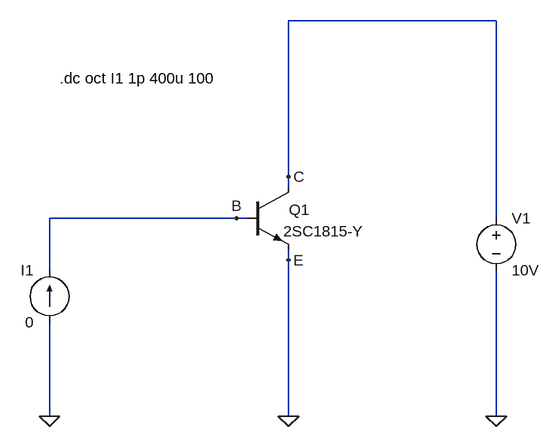
[diagram p0: schematic 1_jikken_vb.asc]
1_jikken_vb.asc, the LTspice schematic file:
Version 4
SHEET 1 880 680
WIRE 592 -112 272 -112
WIRE 272 128 272 -112
WIRE 272 144 272 128
WIRE 192 192 -96 192
WIRE 208 192 192 192
WIRE 592 192 592 -112
WIRE 272 256 272 240
WIRE -96 272 -96 192
WIRE -96 496 -96 352
WIRE 272 496 272 256
WIRE 592 496 592 272
FLAG -96 496 0
FLAG 272 496 0
FLAG 592 496 0
FLAG 272 256 E
FLAG 272 128 C
FLAG 192 192 B
SYMBOL npn 208 144 R0
WINDOW 0 65 35 Left 2
SYMATTR InstName Q1
SYMATTR Value 2SC1815-Y
SYMBOL voltage 592 176 R0
SYMATTR InstName V1
SYMATTR Value 10V
SYMBOL current -96 352 R180
WINDOW 0 24 80 Left 2
WINDOW 3 24 0 Left 2
WINDOW 123 0 0 Left 0
WINDOW 39 0 0 Left 0
SYMATTR InstName I1
SYMATTR Value 0
TEXT -80 -24 Left 2 !.dc oct I1 1p 400u 100

The netlist it stands for:
* 1_jikken_vb.asc
Q1 C B 0 0 2SC1815-Y
V1 C 0 10V
I1 0 B 0
.model NPN NPN
.model PNP PNP
.lib standard.bjt
.dc oct I1 1p 400u 100
.backanno
.end